# EasyEDA schematic RF Nano Controller Update Schematic.json
TITLE: Sheet_1; REV: 1.0; Date: 2020-04-21; Sheet: 1/1; Drawn By: matt_9455; Company: Your Company
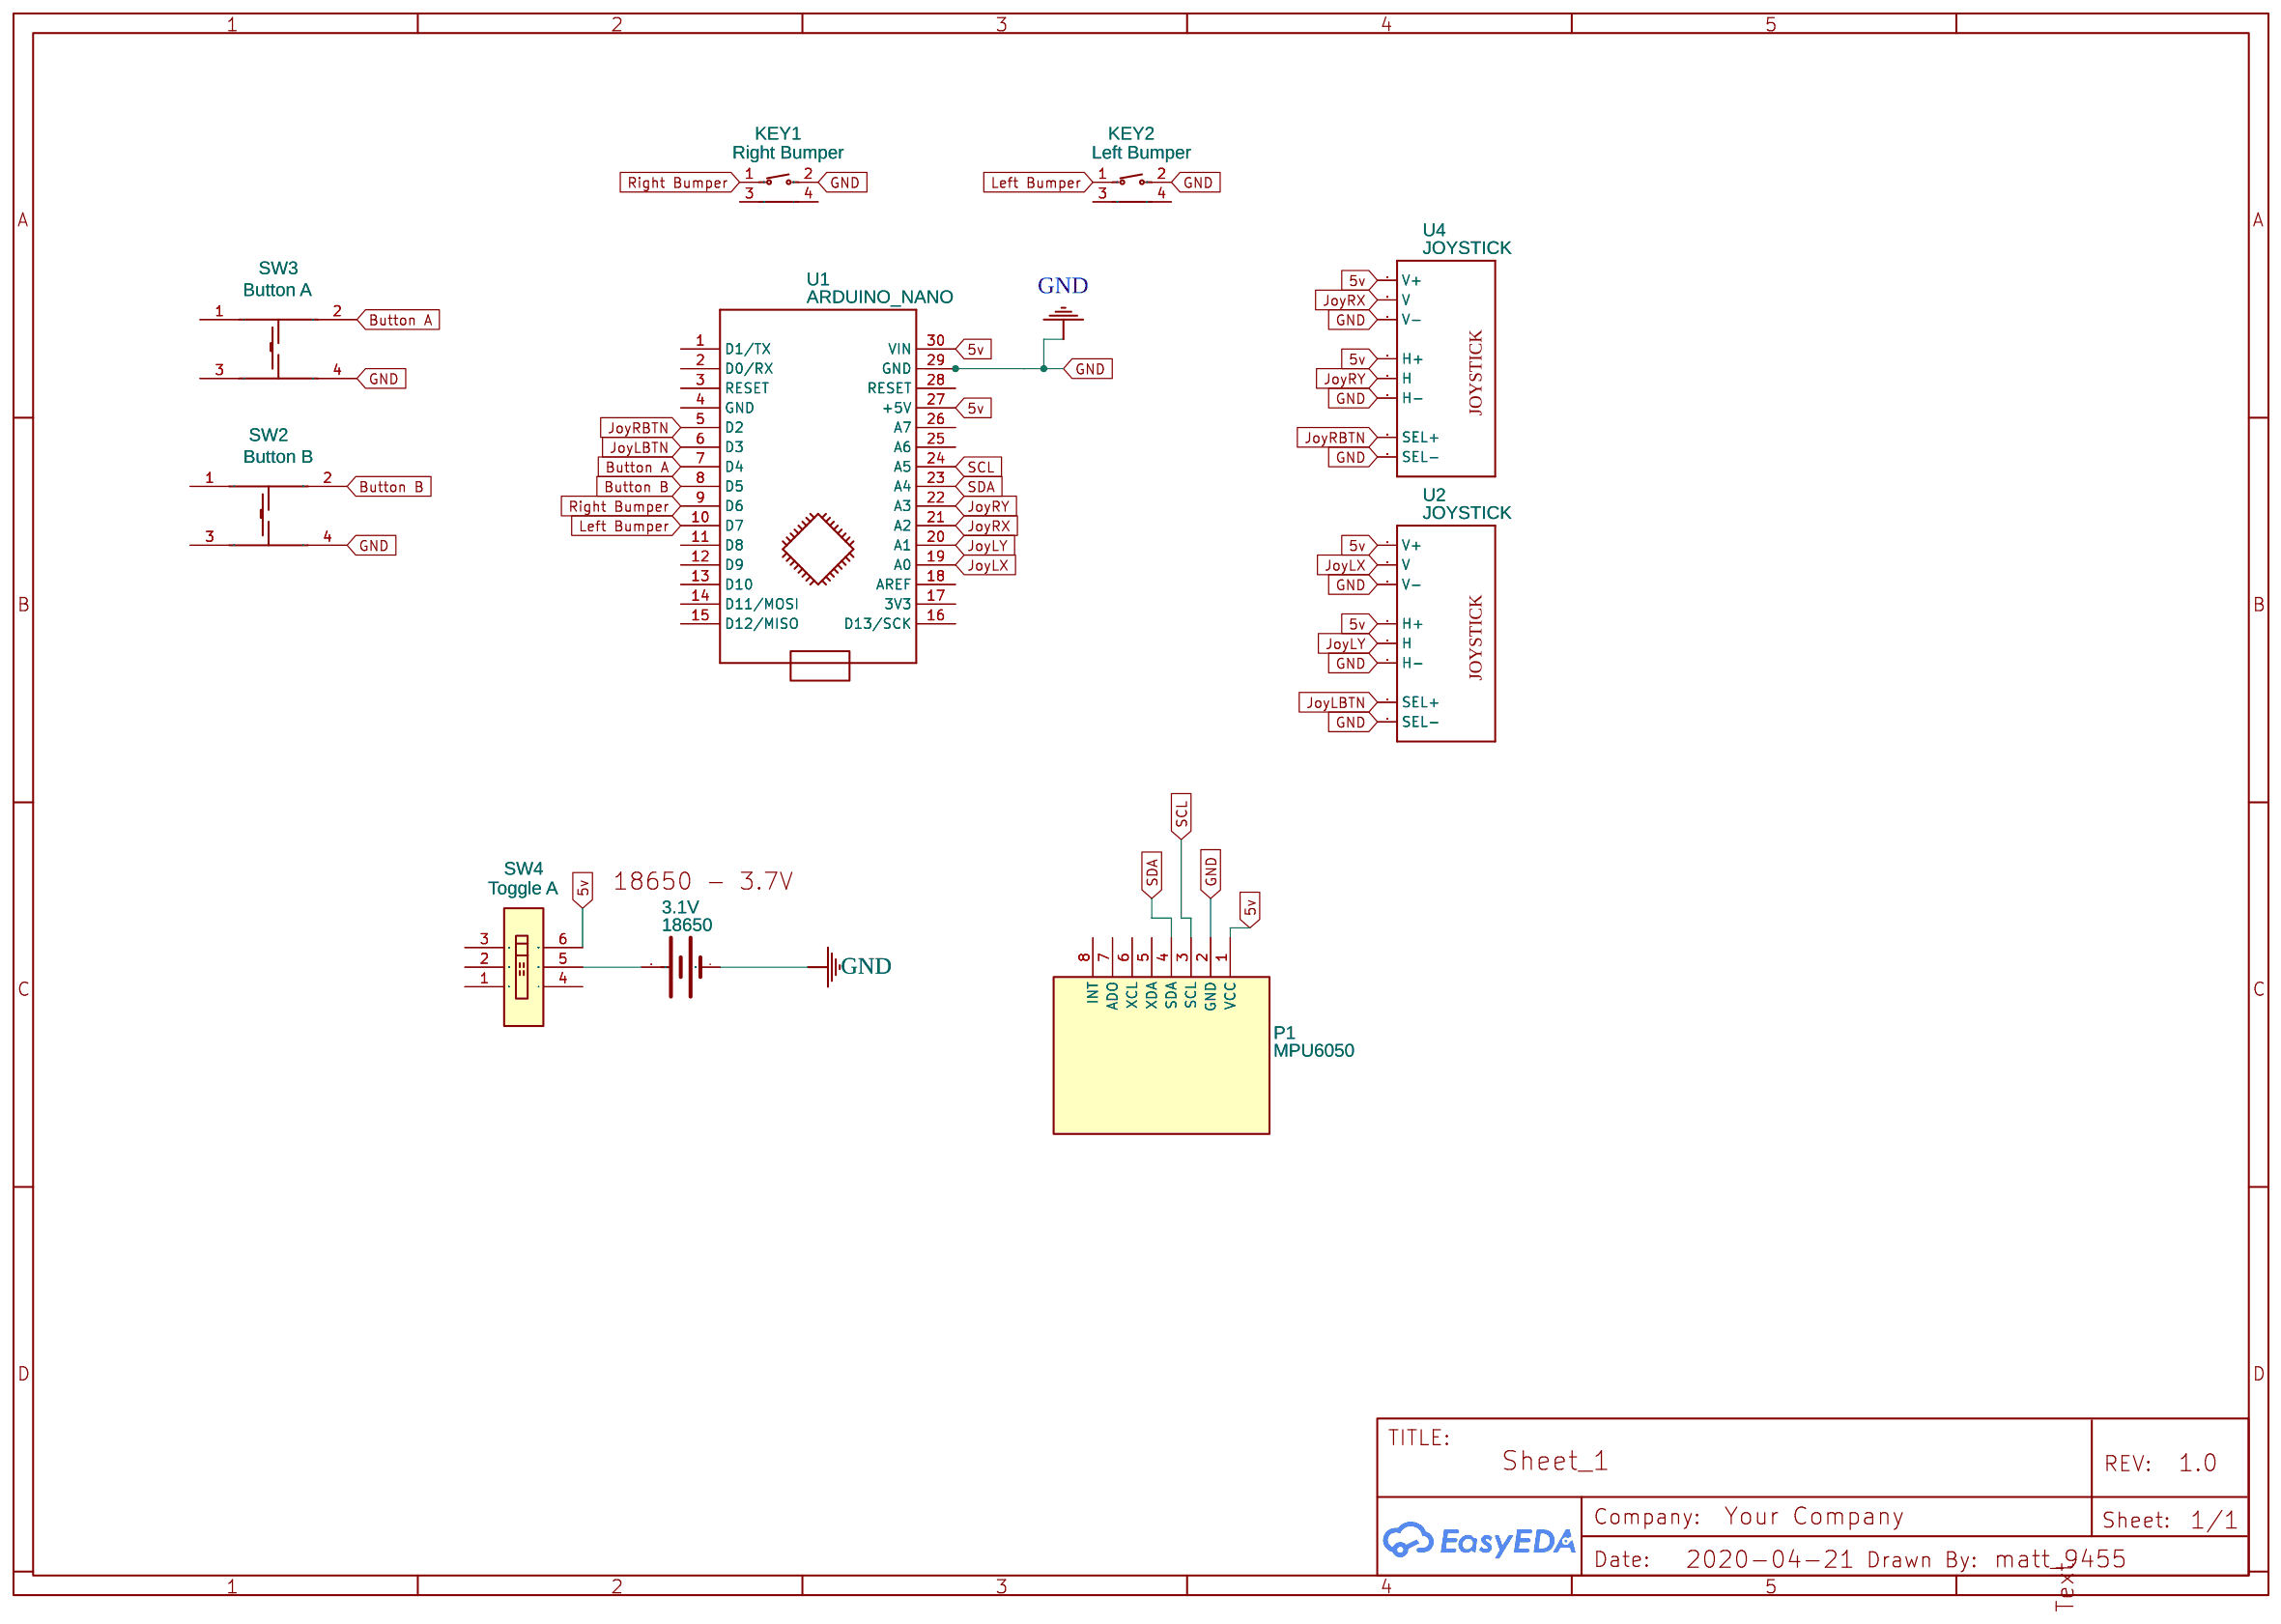
[diagram p0: schematic sheet]

## Parts
3.1V  18650  [18650-HOLDER]
KEY1  Right Bumper  [SW-TH_BBJ6X6X5PH260G]
KEY2  Left Bumper  [SW-TH_BBJ6X6X5PH260G]
P1  MPU6050  [MPU6050]
SW2  Button B  [KEY-TH_4P-L12.0-W12.0-P5.00-LS13.4]
SW3  Button A  [KEY-TH_4P-L12.0-W12.0-P5.00-LS13.4]
SW4  Toggle A  [SW-TH_SSSS213202]
U1  ARDUINO_NANO  [ARDUINO_NANO]
U2  JOYSTICK  [JOYSTICK]
U4  JOYSTICK  [JOYSTICK]

## Library data of the parts
3.1V = 18650: Battery Holder; Contributor: SparkFun
KEY1 KEY2 = Switch,6*6*5Plastic head,260G, 0.25mm,Side foot: Supplier Part: C71832; Supplier: LCSC; Manufacturer: BBJ
P1 = MPU6050: sourceId: 1T5FDZYC8
SW2 SW3 = K2-1841DP-H4SW-02: Supplier: LCSC; Manufacturer: HRO; Contributor: LCSC; Supplier Part: C145864
SW4 = SSSS213202: Supplier: LCSC; Manufacturer: ALPS; Supplier Part: C115375
U1 = ARDUINO_NANO: sourceId: KGSeAWhDB
U2 U4 = JOYSTICK: Contributor: SparkFun

## Nets
5v: P1.1(VCC) SW4.6 U1.27(+5V) U1.30(VIN) U2.H1(H+) U2.V1(V+) U4.H1(H+) U4.V1(V+)
GND: 3.1V.-(1) KEY1.2 KEY2.2 P1.2(GND) SW2.4 SW3.4 U1.29(GND) U2.B2A(SEL-) U2.H3(H-) U2.V3(V-) U4.B2A(SEL-) U4.H3(H-) U4.V3(V-)
Button A: SW3.2 U1.7(D4)
Button B: SW2.2 U1.8(D5)
JoyLBTN: U1.6(D3) U2.B1A(SEL+)
JoyLX: U1.19(A0) U2.V2(V)
JoyLY: U1.20(A1) U2.H2(H)
JoyRBTN: U1.5(D2) U4.B1A(SEL+)
JoyRX: U1.21(A2) U4.V2(V)
JoyRY: U1.22(A3) U4.H2(H)
Left Bumper: KEY2.1 U1.10(D7)
Right Bumper: KEY1.1 U1.9(D6)
SCL: P1.3(SCL) U1.24(A5)
SDA: P1.4(SDA) U1.23(A4)
Net-(3.1V-+): 3.1V.+(2) SW4.5

Not connected (* = marked no-connect by the designer): KEY1 3 4; KEY2 3 4; P1 5(XDA) 6(XCL) 7(ADO) 8(INT); SW2 1 3; SW3 1 3; SW4 1 2 3 4; U1 1(D1/TX) 2(D0/RX) 3(RESET) 4(GND) 11(D8) 12(D9) 13(D10) 14(D11/MOSI) 15(D12/MISO) 16(D13/SCK) 17(3V3) 18(AREF) 25(A6) 26(A7) 28(RESET)
